# EAGLE design BC127_Breakout (EAGLE 6.4)
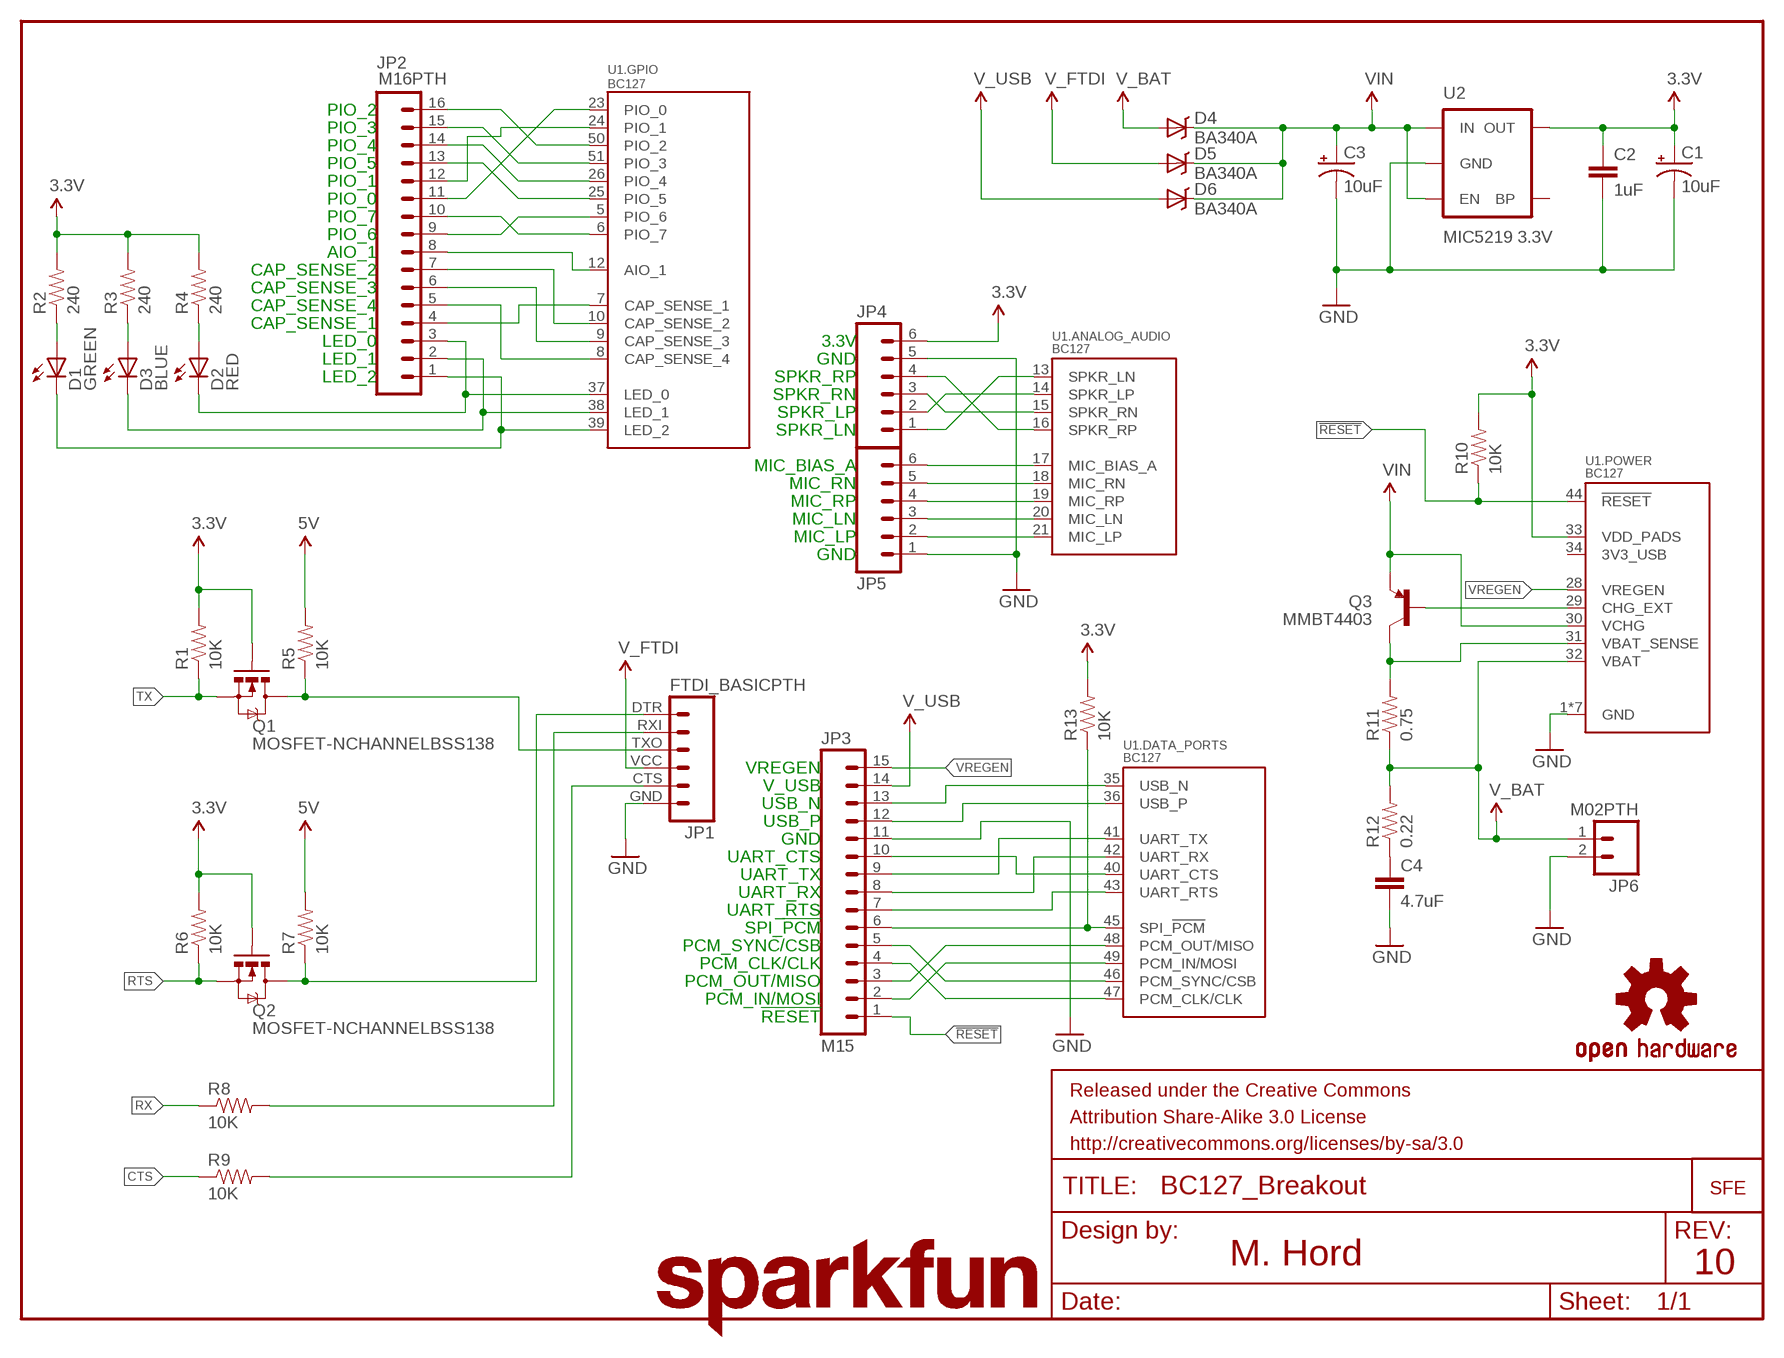
[diagram p0: schematic, sheet 1]

## Parts
C1  10uF  10UF-16V-10%(TANT)  [EIA3216]
C2  1uF  1UF-25V-10%(0805)  [0805]
C3  10uF  10UF-16V-10%(TANT)  [EIA3216]
C4  4.7uF  4.7UF-6.3V-10%(0603)0603  [0603-CAP]
D1  GREEN  LED-GREEN0603  [LED-0603]
D2  RED  LED-RED0603  [LED-0603]
D3  BLUE  LED-BLUE0603  [LED-0603]
D4  BA340A  B340A  [SMA-DIODE]
D5  BA340A  B340A  [SMA-DIODE]
D6  BA340A  B340A  [SMA-DIODE]
FRAME1  FRAME-LETTER  [CREATIVE_COMMONS]
JP1  FTDI_BASICPTH  [FTDI_BASIC]
JP2  M16PTH  [1X16]
JP3  M15  [1X15]
JP4  M06SIP  [1X06]
JP5  M06SIP  [1X06]
JP6  M02PTH  [1X02]
LOGO1  OSHW-LOGOM  [OSHW-LOGO-M]
LOGO2  LOGO-SFENEW  [SFE-NEW-WEBLOGO]
LOGO3  SFE_LOGO_NAME.1_INCH  [SFE_LOGO_NAME_.1]
Q1  MOSFET-NCHANNELBSS138  [SOT23]
Q2  MOSFET-NCHANNELBSS138  [SOT23]
Q3  MMBT4403  TRANSISTOR_PNPMMBT4403  [SOT23]
R1  10K  10KOHM1/10W1%(0603)0603  [0603-RES]
R2  240  240OHM1/10W1%(0603)  [0603-RES]
R3  240  240OHM1/10W1%(0603)  [0603-RES]
R4  240  240OHM1/10W1%(0603)  [0603-RES]
R5  10K  10KOHM1/10W1%(0603)0603  [0603-RES]
R6  10K  10KOHM1/10W1%(0603)0603  [0603-RES]
R7  10K  10KOHM1/10W1%(0603)0603  [0603-RES]
R8  10K  10KOHM1/10W1%(0603)0603  [0603-RES]
R9  10K  10KOHM1/10W1%(0603)0603  [0603-RES]
R10  10K  10KOHM1/10W1%(0603)0603  [0603-RES]
R11  0.75  0.75OHM1/4W1%(0805)  [0805]
R12  0.22  0.22OHM1/4W1%(0805)  [0805]
R13  10K  10KOHM1/10W1%(0603)0603  [0603-RES]
U1  BC127  BC127EXTRA_PASTE  [BC127_XTRA_PASTE]
U2  MIC5219 3.3V  V_REG_MIC52193.3V  [SOT23-5]

## Nets
3.3V: C1.A(+) C2.1 JP4.6 Q1.1(G) Q2.1(G) R1.2 R2.2 R3.2 R4.2 R6.2 R10.2 R13.2 U1.33(.POWER:VDD_PADS) U2.5(OUT)
5V_CTS: JP1.CTS R9.2
5V_RTS: JP1.DTR Q2.3(D) R7.1
5V_RX: JP1.RXI R8.2
5V_TX: JP1.TXO Q1.3(D) R5.1
!RESET: JP3.1 R10.1 U1.44(.POWER:!RESET)
AIO_1: JP2.8 U1.12(.GPIO:AIO_1)
CAP_SENSE_1: JP2.4 U1.7(.GPIO:CAP_SENSE_1)
CAP_SENSE_2: JP2.7 U1.10(.GPIO:CAP_SENSE_2)
CAP_SENSE_3: JP2.6 U1.9(.GPIO:CAP_SENSE_3)
CAP_SENSE_4: JP2.5 U1.8(.GPIO:CAP_SENSE_4)
CHG_EXT: Q3.1(B) U1.29(.POWER:CHG_EXT)
CTS: JP3.10 R9.1 U1.40(.DATA_PORTS:UART_CTS)
GND: C1.C(-) C2.2 C3.C(-) C4.2 JP1.GND JP3.11 JP4.5 JP5.1 JP6.2 U1.1(.POWER:GND) U1.2(.POWER:GND) U1.3(.POWER:GND) U1.4(.POWER:GND) U1.11(.POWER:GND) U1.22(.POWER:GND) U1.27(.POWER:GND) U2.2(GND)
LED_0: D2.C JP2.3 U1.37(.GPIO:LED_0)
LED_1: D3.C JP2.2 U1.38(.GPIO:LED_1)
LED_2: D1.C JP2.1 U1.39(.GPIO:LED_2)
MIC_BIAS_A: JP5.6 U1.17(.ANALOG_AUDIO:MIC_BIAS_A)
MIC_LN: JP5.3 U1.20(.ANALOG_AUDIO:MIC_LN)
MIC_LP: JP5.2 U1.21(.ANALOG_AUDIO:MIC_LP)
MIC_RN: JP5.5 U1.18(.ANALOG_AUDIO:MIC_RN)
MIC_RP: JP5.4 U1.19(.ANALOG_AUDIO:MIC_RP)
N$2: D3.A R3.1
N$6: D2.A R4.1
N$7: D1.A R2.1
N$28: C4.1 R12.1
PCM_CLK/CLK: JP3.4 U1.47(.DATA_PORTS:PCM_CLK/CLK)
PCM_IN/MOSI: JP3.2 U1.49(.DATA_PORTS:PCM_IN/MOSI)
PCM_OUT/MISO: JP3.3 U1.48(.DATA_PORTS:PCM_OUT/MISO)
PCM_SYNC/CSB: JP3.5 U1.46(.DATA_PORTS:PCM_SYNC/CSB)
PIO_0: JP2.11 U1.23(.GPIO:PIO_0)
PIO_1: JP2.12 U1.24(.GPIO:PIO_1)
PIO_2: JP2.16 U1.50(.GPIO:PIO_2)
PIO_3: JP2.15 U1.51(.GPIO:PIO_3)
PIO_4: JP2.14 U1.26(.GPIO:PIO_4)
PIO_5: JP2.13 U1.25(.GPIO:PIO_5)
PIO_6: JP2.9 U1.5(.GPIO:PIO_6)
PIO_7: JP2.10 U1.6(.GPIO:PIO_7)
RTS: JP3.7 Q2.2(S) R6.1 U1.43(.DATA_PORTS:UART_RTS)
RX: JP3.8 R8.1 U1.42(.DATA_PORTS:UART_RX)
SPI_!PCM: JP3.6 R13.1 U1.45(.DATA_PORTS:SPI_!PCM)
SPKR_LN: JP4.1 U1.13(.ANALOG_AUDIO:SPKR_LN)
SPKR_LP: JP4.2 U1.14(.ANALOG_AUDIO:SPKR_LP)
SPKR_RN: JP4.3 U1.15(.ANALOG_AUDIO:SPKR_RN)
SPKR_RP: JP4.4 U1.16(.ANALOG_AUDIO:SPKR_RP)
TX: JP3.9 Q1.2(S) R1.1 U1.41(.DATA_PORTS:UART_TX)
USB_N: JP3.13 U1.35(.DATA_PORTS:USB_N)
USB_P: JP3.12 U1.36(.DATA_PORTS:USB_P)
V_BAT: D4.A JP6.1 R11.1 R12.2 U1.32(.POWER:VBAT)
V_FTDI: D5.A JP1.VCC
V_USB: D6.A JP3.14
VBAT_SENSE: Q3.3(C) R11.2 U1.31(.POWER:VBAT_SENSE)
VIN: C3.A(+) D4.C D5.C D6.C Q3.2(E) R5.2 R7.2 U1.30(.POWER:VCHG) U2.1(IN) U2.3(EN) ; supply symbol labelled 5V
VREGEN: JP3.15 U1.28(.POWER:VREGEN)
Unconnected: U1.34(.POWER:3V3_USB) U2.4(BP)

## Notes on the sheet
- PIO_2
- PIO_3
- PIO_4
- PIO_5
- PIO_1
- PIO_0
- PIO_7
- PIO_6
- AIO_1
- CAP_SENSE_2
- CAP_SENSE_3
- CAP_SENSE_4
- CAP_SENSE_1
- LED_0 | 3.3V
- LED_1 | GND
- LED_2 | SPKR_RP
- SPKR_RN
- SPKR_LP
- SPKR_LN
- MIC_BIAS_A
- MIC_RN
- MIC_RP
- MIC_LN
- MIC_LP
- GND
- VREGEN
- V_USB
- USB_N
- USB_P
- GND
- UART_CTS
- UART_TX
- UART_RX
- UART_RTS
- SPI_!PCM
- PCM_SYNC/CSB
- PCM_CLK/CLK
- PCM_OUT/MISO
- PCM_IN/MOSI
- !RESET
- M. Hord | 10

## Library data of the parts
C1 C3 = SparkFun-Capacitors:10UF-16V-10%(TANT): CAP-00811 1206/EIA-3216 Tantalum capacitor; PROD_ID: CAP-00811
C2 = SparkFun-Capacitors:1UF-25V-10%(0805): CAP-08064; PROD_ID: CAP-08064
C4 = SparkFun-Capacitors:4.7UF-6.3V-10%(0603): CAP-08280; PROD_ID: CAP-08280
D1 = SparkFun-LED:LED-GREEN: Various green LEDs 0603- DIO-00821 LARGE- DIO-00862 LILYPAD- DIO-09910; PROD_ID: DIO-00821
D2 = SparkFun-LED:LED-RED: Assorted Red LEDs LilyPad 1206- DIO-09912 1206- DIO-00809 0603- DIO-00819; PROD_ID: DIO-00819
D3 = SparkFun-LED:LED-BLUE: Blue LEDs for production use Various blue LEDs stocked by SparkFun production 0603 - DIO-08575 Rebel - DIO-09553 1206 - DIO-09911; PROD_ID: DIO-08575
D4-D6 = SparkFun-DiscreteSemi:B340A: Schottky Diode 3A-40V; PROD_ID: DIO-09886
FRAME1 = SparkFun-Aesthetics:FRAME-LETTER: Schematic Frame Standard 8.5x11 US Letter frame
JP1 = SparkFun-Connectors:FTDI_BASIC: FTDI Basic header with labels
JP2 = SparkFun-Connectors:M16: 1x16 .1" header
JP3 = SparkFun-Connectors:M15: Header 15 Standard 15-pin 0.1" header. Use with straight break away headers (SKU : PRT-00116), right angle break away headers (PRT-00553), swiss pins (PRT-00743), machine pins (PRT-00117), and female headers (PRT-00115).
JP4 JP5 = SparkFun-Connectors:M06: Header 6 Standard 6-pin 0.1" header. Use with straight break away headers (SKU : PRT-00116), right angle break away headers (PRT-00553), swiss pins (PRT-00743), machine pins (PRT-00117), and female headers (PRT-00115). Molex polarized connector foot print use with SKU : PRT-08094 with associated crimp pins and housings. NOTES ON THE VARIANTS LOCK and LOCK_LONGPADS... This footprint was designed to help hold the alignment of a through-hole component (i.e. 6-pin header) while soldering it into place. You may notice that each hole has been shifted either up or down by 0.005 of an inch from it's more standard position (which is a perfectly straight line). This slight alteration caused the pins (the squares in the middle) to touch the edges of the holes. Because they are alternating, it causes a "brace" to hold the component in place. 0.005 has proven to be the perfect amount of "off-center" position when using our standard breakaway headers. Although looks a little odd when you look at the bare footprint, once you have a header in there, the alteration is very hard to notice. Also,if you push a header all the way into place, it is covered up entirely on the bottom side. This idea of altering the position of holes to aid alignment will be further integrated into the Sparkfun Library for other footprints. It can help hold any component with 3 or more connection pins.
JP6 = SparkFun-Connectors:M02: Standard 2-pin 0.1" header. Use with - straight break away headers ( PRT-00116) - right angle break away headers (PRT-00553) - swiss pins (PRT-00743) - machine pins (PRT-00117) - female headers (PRT-00115) Molex polarized connector foot print use with: PRT-08233 with associated crimp pins and housings. 2.54_SCREWTERM for use with PRT-10571. 3.5mm Screw Terminal footprints for PRT-08084 5mm Screw Terminal footprints for use with PRT-08433
LOGO1 = SparkFun-Aesthetics:OSHW-LOGO: Open Source Hardware Logo This logo indicates the piece of hardware it is found on incorporates a OSHW license and/or adheres to the definition of open source hardware found here: http://freedomdefined.org/OSHW
LOGO2 = SparkFun-Aesthetics:LOGO-SFE: Spark Fun Electronics PCB Logo This is the standard Spark Fun Electronics PCB logo.
LOGO3 = SparkFun-Aesthetics:SFE_LOGO_NAME: SFE Logo, name only This is the SparkFun name logo. The logo on the schematic will always be the same size; the package variant is the height of the flame part of the logo (or the height the flame would be, if it were drawn). Default layer for the logo on the board is tSilk.
Q1 Q2 = SparkFun-DiscreteSemi:MOSFET-NCHANNEL: Common NMOSFET Parts MFG P/N Store ID Prod ID FDD8780 TRANS-09984 SI7820DN TRANS-11055 FDS6630A IC-08089 2N7002PW TRANS-11151 FQP30N06L COM-10213 TRANS-10060 BSS123LT1G TRANS-08345 BSS138 TRANS-00830 BS170 2N7000; PROD_ID: TRANS-00830
Q3 = SparkFun-DiscreteSemi:TRANSISTOR_PNP: Generic PNP BJT Double check pinouts against datasheets- not all devices are the same! MMBT3906 - 40V 200mA SOT-23 (TRANS-08052) MMBT4403 - 40V 600mA SOT-23 (TRANS-09245); PROD_ID: TRANS-09245
R1 R5-R10 R13 = SparkFun-Resistors:10KOHM1/10W1%(0603): RES-00824; PROD_ID: RES-00824
R2-R4 = SparkFun-Resistors:240OHM1/10W1%(0603): RES-07849; PROD_ID: RES-07849
R11 = SparkFun-Resistors:0.75OHM1/4W1%(0805): RES-08474; PROD_ID: RES-08474
R12 = SparkFun-Resistors:0.22OHM1/4W1%(0805): RES-09883; PROD_ID: RES-09883
U1 = SparkFun-RF:BC127: Blue Creations BC127 BLE module Hyper-competent Bluetooth 4.0 module, with: - Pre-4.0 support - 4 Cap sense inputs - 1 Analog input - 8 GPIO - 3 Open-drain LED drivers - Onboard battery charge circuitry - SPP/UART support - PCM Audio support - SPI port - Built-in USB - All kinds of other crazy crap
U2 = SparkFun-PowerIC:V_REG_MIC5219: V_REG MIC5219 Standard 500mA LDO voltage regulator in SOT-23 layout. Micrel part MIC5219. BP (by-pass) pin is used to lower output noise with 470pF cap, may be left open.; PROD_ID: VREG-09872

## Board
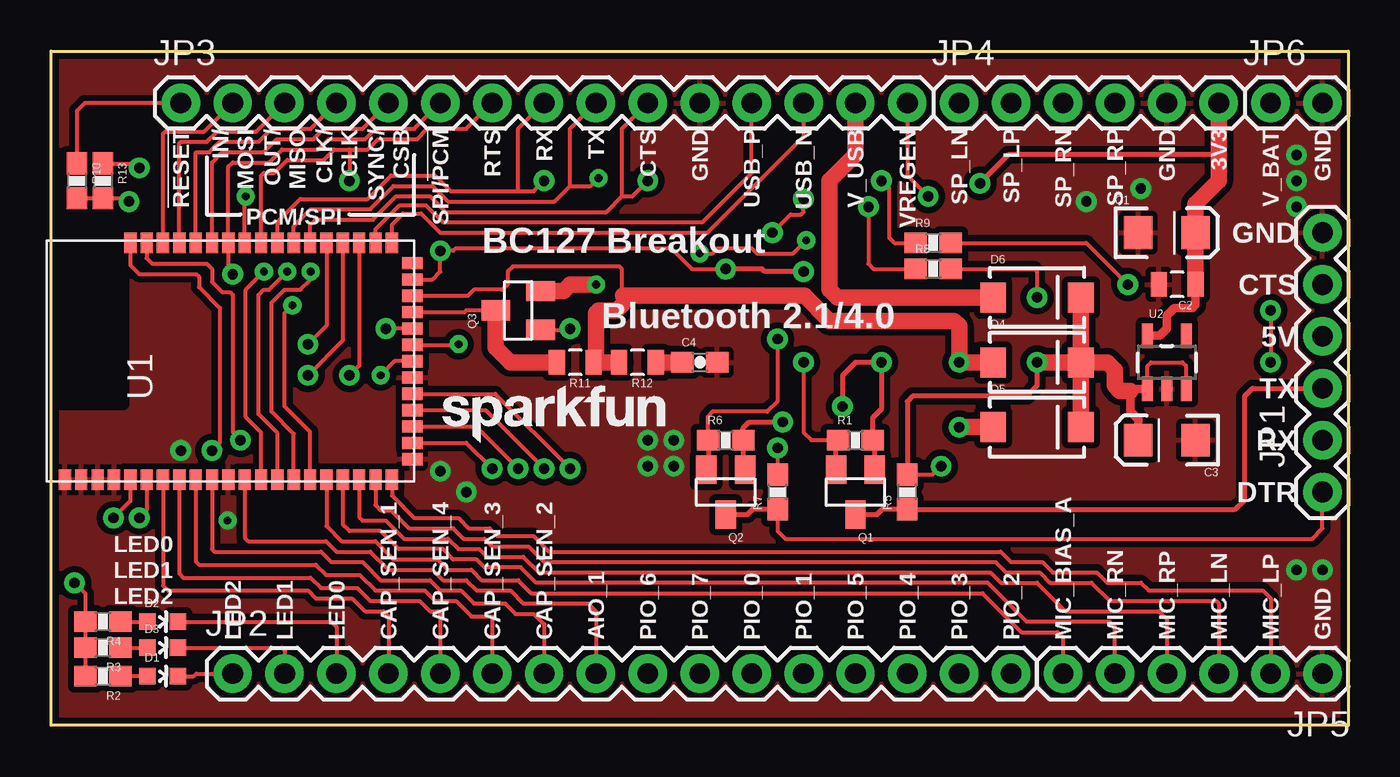
[diagram p1: board, top side]
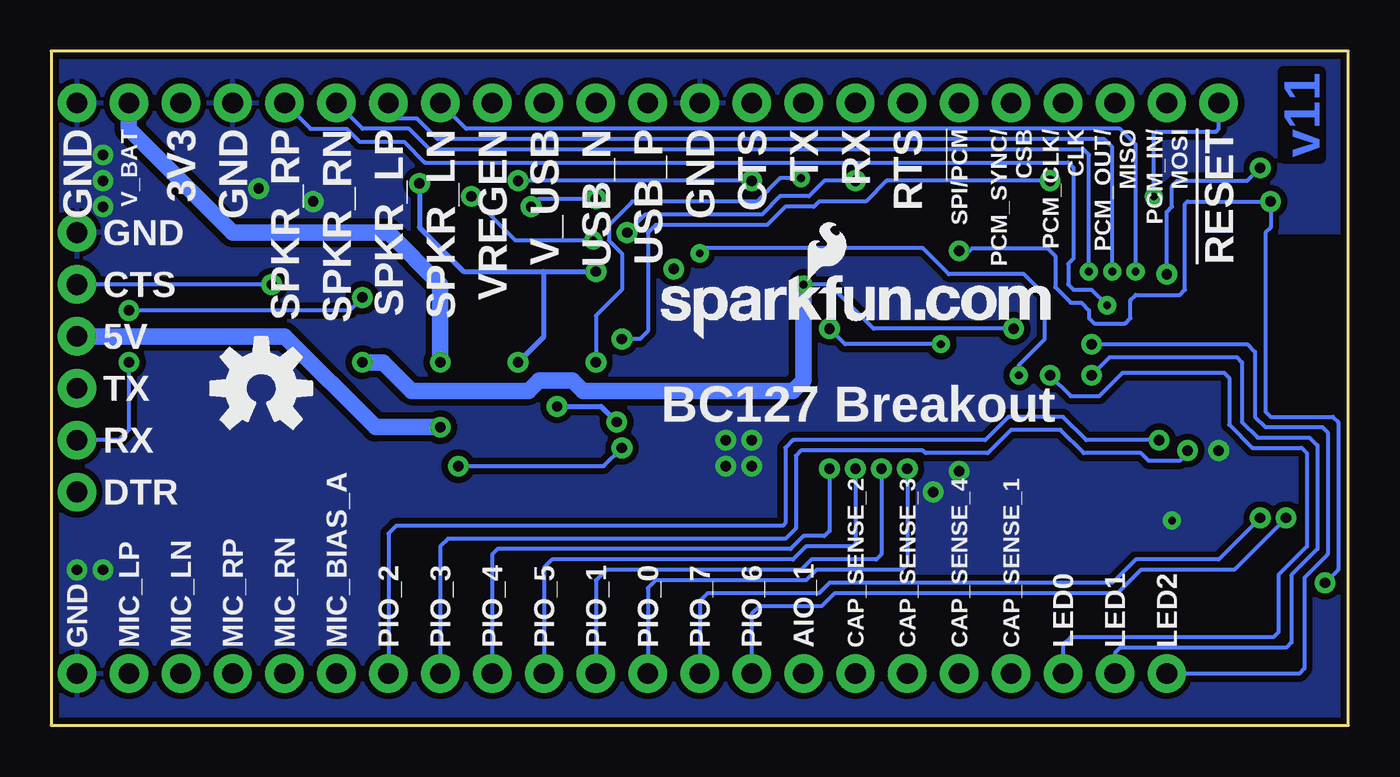
[diagram p2: board, bottom side, seen from below]

Size 63.5 x 33.02 mm. Coordinates in mm from the lower left corner, seen from the top.
Outline: 0,0 0,33.02 63.5,33.02 63.5,0 0,0
Copper layers (1*16): Top 0.035mm / dielectric 1.5mm / Bottom 0.035mm
Design rules "Sparkfun *": minimum track width 8mil, minimum drill 20mil, track to track 8mil, track to pad 8mil, pad to pad 8mil, via to via 8mil, smd to smd 8mil, copper to edge 8mil, drill to drill 8mil, minimum pad ring 12mil, minimum via ring 10mil, stop-mask expansion 4mil, vias tented up to drill 20mil, thermal gap 10mil

### Footprints (pad centres in the part's own frame; a part is rotated, then mirrored left to right if it is on the bottom)
EIA3216 = smd 1.4 x 1.6: A 1.4,0; C -1.4,0
0805 = smd 0.8 x 1.2: 1 -0.9,0; 2 0.9,0
0603-CAP = smd 1.1 x 1: 1 -0.85,0; 2 0.85,0
LED-0603 = smd 0.8 x 0.8: A 0,-0.75; C 0,0.75
SMA-DIODE = smd 1.27 x 1.47: A -2.15,0; C 2.15,0
FTDI_BASIC = drill 1.016 pad 1.88: CTS 10.16,0; DTR 0,0; GND 12.7,0; RXI 2.54,0; TXO 5.08,0; VCC 7.62,0
1X16 = drill 1.016 pad 1.88: 1 0,0; 2 2.54,0; 3 5.08,0; 4 7.62,0; 5 10.16,0; 6 12.7,0; 7 15.24,0; 8 17.78,0; 9 20.32,0; 10 22.86,0; 11 25.4,0; 12 27.94,0; 13 30.48,0; 14 33.02,0; 15 35.56,0; 16 38.1,0
1X15 = drill 1.016 pad 1.88: 1 0,0; 2 2.54,0; 3 5.08,0; 4 7.62,0; 5 10.16,0; 6 12.7,0; 7 15.24,0; 8 17.78,0; 9 20.32,0; 10 22.86,0; 11 25.4,0; 12 27.94,0; 13 30.48,0; 14 33.02,0; 15 35.56,0
1X06 = drill 1.016 pad 1.88: 1 0,0; 2 2.54,0; 3 5.08,0; 4 7.62,0; 5 10.16,0; 6 12.7,0
1X02 = drill 1.016 pad 1.88: 1 0,0; 2 2.54,0
SOT23 = smd 1 x 1.4: 1 -0.95,-1.1; 2 0.95,-1.1; 3 0,1.1
0603-RES = smd 1.1 x 1: 1 -0.85,0; 2 0.85,0
BC127_XTRA_PASTE = smd 1 x 0.6: 1 -5.8,8.1; 2 -5.8,7.3; 3 -5.8,6.5; 4 -5.8,5.7; 5 -5.8,4.9; 6 -5.8,4.1; 7 -5.8,3.3; 8 -5.8,2.5; 9 -5.8,1.7; 10 -5.8,0.9; 11 -5.8,0.1; 12 -5.8,-0.7; 13 -5.8,-1.5; 14 -5.8,-2.3; 15 -5.8,-3.1; 16 -5.8,-3.9; 17 -5.8,-4.7; 18 -5.8,-5.5; 19 -5.8,-6.3; 20 -5.8,-7.1; 21 -5.8,-7.9; 35 5.8,-7.9; 36 5.8,-7.1; 37 5.8,-6.3; 38 5.8,-5.5; 39 5.8,-4.7; 40 5.8,-3.9; 41 5.8,-3.1; 42 5.8,-2.3; 43 5.8,-1.5; 44 5.8,-0.7; 45 5.8,0.1; 46 5.8,0.9; 47 5.8,1.7; 48 5.8,2.5; 49 5.8,3.3; 50 5.8,4.1; 51 5.8,4.9 | smd 0.6 x 1: 22 -4.8,-8.9; 23 -4,-8.9; 24 -3.2,-8.9; 25 -2.4,-8.9; 26 -1.6,-8.9; 27 -0.8,-8.9; 28 0,-8.9; 29 0.8,-8.9; 30 1.6,-8.9; 31 2.4,-8.9; 32 3.2,-8.9; 33 4,-8.9; 34 4.8,-8.9
SOT23-5 = smd 0.55 x 1.2: 1 -0.95,-1.3; 2 0,-1.3; 3 0.95,-1.3; 4 0.95,1.3; 5 -0.95,1.3

### Placement (x,y rotation side)
C1  54.61,24.13 0 top
C2  55.12,21.59 180 top
C3  54.61,13.97 180 top
C4  31.75,17.78 0 top
D1  5.46,2.41 270 top
D2  5.46,5.08 270 top
D3  5.46,3.81 270 top
D4  48.26,17.78 0 top
D5  48.26,14.61 0 top
D6  48.26,20.95 0 top
FRAME1  21.59,-6.35 0 top  (outside the outline)
JP1  62.23,11.43 90 top
JP2  8.89,2.54 0 top
JP3  6.35,30.48 0 top
JP4  44.45,30.48 0 top
JP5  62.23,2.54 180 top
JP6  59.69,30.48 0 top
LOGO1  53.21,16.51 0 bottom
LOGO2  33.66,18.92 0 bottom
LOGO3  18.67,13.34 0 top
Q1  39.37,11.43 180 top
Q2  33.02,11.43 180 top
Q3  22.86,20.32 90 top
R1  39.37,13.97 0 top
R2  2.54,2.41 180 top
R3  2.54,3.81 180 top
R4  2.54,5.08 180 top
R5  41.91,11.43 90 top
R6  33.02,13.97 0 top
R7  35.56,11.43 90 top
R8  43.18,22.35 0 top
R9  43.18,23.62 0 top
R10  1.27,26.67 270 top
R11  25.65,17.78 180 top
R12  28.7,17.78 180 top
R13  2.54,26.67 270 top
U1  8.78,17.84 90 top
U2  54.61,17.78 0 top

### Tracks (layer width: path | path; a pad name or v marks a point on that pad's centre or on a via)
3.3V  (via drill 0.51)
  Top 0.203: R10.2 R13.2 3.64,25.82 v3.81,25.65 | v33.02,22.35 31.37,22.35 30.35,23.37 19.81,23.37 19.68,23.24 v19.05,23.24 v19.04,23.23 19.04,22.22 18.66,21.84 U1.33 | v1.14,6.99 1.69,6.44 R4.2 R3.2 R2.2
  Top 0.254: Q1.1 40.32,13.87 R1.2 40.22,15.07 40.64,15.49 v40.64,17.78 39.37,17.78 38.73,17.14 v38.73,15.62 | Q2.1 33.87,12.63 R6.2 33.87,14.57 34.16,14.86 v35.81,14.86 | 57.15,27.94 46.86,27.94 v45.47,26.54 | v36.83,22.22 34.92,22.22 34.8,22.35 v33.02,22.35
  Top 0.406: 56.01,21.6 56.01,20.57 55.88,20.45 54.99,20.45 54.61,20.07 54.61,19.43 54.26,19.08 U2.5
  Top 0.813: JP4.6 57.15,27.94 57.15,26.67 56.01,25.53 C1.A | C1.A | C1.A 56.01,21.6 C2.1
  Bottom 0.203: v19.05,23.24 18.54,23.24 18.41,23.37 14.73,23.37 14.35,22.99 14.35,21.46 13.59,20.7 13.08,20.7 12.7,20.32 12.7,19.94 12.45,19.68 10.92,19.68 10.67,19.94 10.67,20.83 10.41,21.08 8.26,21.08 8,21.34 8,25.53 7.87,25.65 v3.81,25.65 3.81,24.38 4.06,24.13 4.06,15.37 3.81,15.11 0.76,15.11 0.51,14.86 0.51,7.62 v1.14,6.99
  Bottom 0.254: v45.47,26.54 45.47,24.38 43.31,22.22 39.4,22.22 | 39.4,22.22 v36.83,22.22 | 39.4,22.22 39.4,19.02 v40.64,17.78 | v38.73,15.62 36.58,15.62 v35.81,14.86
5V_CTS  (via drill 0.51)
  Top 0.203: R9.2 50.67,23.62 v52.7,21.59
  Bottom 0.203: v52.7,21.59 JP1.CTS
5V_RTS
  Top 0.203: R7.1 35.56,9.53 35.94,9.14 61.72,9.14 62.23,9.65 JP1.DTR
  Top 0.254: Q2.3 34.08,10.33 34.33,10.58 R7.1
5V_RX  (via drill 0.51)
  Top 0.203: R8.2 48.13,22.35 48.26,22.22 v48.26,20.95 | v59.69,20.32 v59.69,17.78
  Bottom 0.203: v48.26,20.95 48.9,20.32 v59.69,20.32 | v59.69,17.78 59.69,14.48 60.2,13.97 JP1.RXI
5V_TX
  Top 0.254: Q1.3 40.43,10.33 40.68,10.58 R5.1 57.95,10.58 58.42,11.05 58.42,16.13 58.8,16.51 JP1.TXO
!RESET  (via drill 0.38)
  Top 0.203: JP3.1 1.65,30.48 1.27,30.1 R10.1 | U1.44 9.48,25.86 v9.53,25.91
  Bottom 0.203: v9.53,25.91 9.53,28.96 9.4,29.08 6.48,29.08 6.35,29.21 JP3.1
AIO_1
  Top 0.203: U1.12 9.48,9.19 9.65,9.02 13.46,9.02 13.97,8.51 15.62,8.51 16.51,7.62 18.67,7.62 19.18,7.11 20.32,7.11 20.83,6.6 22.48,6.6 23.11,5.97 26.29,5.97 26.67,5.59 JP2.8
CAP_SENSE_1
  Top 0.203: U1.7 5.48,6.84 5.71,6.6 12.57,6.6 12.95,6.22 14.73,6.22 15.37,5.59 16.26,5.59 16.51,5.33 JP2.4
CAP_SENSE_2
  Top 0.203: U1.10 7.88,8.63 8,8.51 13.21,8.51 13.72,8 15.24,8 16.13,7.11 18.54,7.11 19.05,6.6 20.07,6.6 20.7,5.97 22.23,5.97 22.73,5.46 23.62,5.46 24.13,4.95 JP2.7
CAP_SENSE_3
  Top 0.203: U1.9 7.08,8.03 7.24,7.87 12.95,7.87 13.46,7.37 15.11,7.37 15.88,6.6 18.29,6.6 18.8,6.1 19.81,6.1 20.57,5.33 21.59,5.33 JP2.6
CAP_SENSE_4
  Top 0.203: U1.8 6.28,7.44 6.48,7.24 12.7,7.24 13.21,6.73 14.99,6.73 15.62,6.1 18.03,6.1 18.54,5.59 18.92,5.59 19.05,5.46 JP2.5
CHG_EXT  (via drill 0.38, 0.51)
  Top 0.203: U1.29 19.91,18.64 v19.94,18.67 | Q3.1 25.34,19.37 v25.4,19.43
  Bottom 0.203: v19.94,18.67 24.64,18.67 v25.4,19.43
CTS  (via drill 0.51)
  Top 0.203: U1.40 12.68,24.49 12.95,24.77 15.75,24.77 16.89,25.91 18.54,25.91 19.3,25.15 27.18,25.15 27.94,25.91 | 27.94,25.91 28.45,25.91 v29.21,26.67 | 27.94,25.91 27.94,29.21 JP3.10 | v40.64,26.67 41.02,26.29 41.02,23.88 41.27,23.62 R9.1
  Bottom 0.203: v29.21,26.67 v40.64,26.67
GND  (via drill 0.38, 0.51)
  other vias: 29.21,12.7 8.64,10.03 60.96,7.62 62.23,7.62 20.32,11.43 19.05,12.45 29.21,13.97 30.48,12.7 30.48,13.97 50.67,25.65 53.34,26.29 60.96,26.67 60.96,25.4 60.96,27.94 6.35,13.46
  pour Top (isolate 0.305): 0,33.02 63.5,33.02 63.5,0 0,0
  pour Bottom (isolate 0.305): 0,33.02 63.5,33.02 63.5,0 0,0
LED_0  (via drill 0.51)
  Top 0.203: D2.C 13.72,5.08 13.97,4.83 JP2.3 | U1.37 15.08,17.62 v14.61,17.14
  Bottom 0.203: v14.61,17.14 13.59,16.13 12.19,16.13 11.05,17.27 6.1,17.27 5.84,17.02 5.84,14.73 4.7,13.59 2.29,13.59 2.03,13.34 2.03,8.76 3.43,7.37 3.43,4.57 3.68,4.32 13.59,4.32 13.97,3.94 JP2.3
LED_1  (via drill 0.51)
  Top 0.203: D3.C 11.3,3.81 11.43,3.68 JP2.2 | U1.38 14.28,18.85 v12.57,17.14
  Bottom 0.203: v12.57,17.14 11.68,18.03 5.46,18.03 5.21,17.78 5.21,14.86 4.45,14.1 1.91,14.1 1.52,13.72 1.52,8.64 2.79,7.37 2.79,4.06 3.05,3.81 11.18,3.81 11.43,3.56 JP2.2
LED_2  (via drill 0.51)
  Top 0.203: D1.C 6.99,2.41 7.11,2.54 JP2.1 | U1.39 13.48,19.58 v12.57,18.67
  Bottom 0.203: v12.57,18.67 4.95,18.67 4.57,18.29 4.57,15.11 4.06,14.61 1.27,14.61 1.02,14.35 1.02,8.38 2.16,7.24 2.16,2.79 2.41,2.54 JP2.1
MIC_BIAS_A
  Top 0.203: U1.17 13.48,9.76 14.22,9.02 15.88,9.02 16.76,8.13 18.92,8.13 19.43,7.62 20.57,7.62 21.08,7.11 22.86,7.11 23.5,6.48 45.59,6.48 47.5,4.57 49.28,4.57 49.53,4.32 JP5.6
MIC_LN
  Top 0.203: U1.20 15.88,10.79 16.13,10.54 16.64,10.54 17.53,9.65 19.68,9.65 20.19,9.14 21.21,9.14 21.59,8.76 23.37,8.76 24.13,8 46.23,8 46.74,7.49 48.39,7.49 48.9,6.99 50.93,6.99 51.82,6.1 57.02,6.1 57.15,5.97 JP5.3
MIC_LP
  Top 0.203: U1.21 16.68,11.26 17.78,10.16 19.94,10.16 20.45,9.65 21.46,9.65 21.84,9.27 23.62,9.27 24.38,8.51 46.48,8.51 46.99,8 48.51,8 49.02,7.49 51.18,7.49 51.69,6.99 53.34,6.99 53.72,6.6 59.31,6.6 59.69,6.22 JP5.2
MIC_RN
  Top 0.203: JP5.5 52.07,4.83 51.82,5.08 47.75,5.08 45.85,6.99 23.75,6.99 22.99,7.75 21.21,7.75 20.83,8.13 19.68,8.13 19.18,8.64 17.02,8.64 16.13,9.53 14.61,9.53 14.28,9.85 U1.18
MIC_RP
  Top 0.203: U1.19 15.08,10.19 15.24,10.03 16.38,10.03 17.27,9.14 19.43,9.14 19.94,8.64 20.95,8.64 21.34,8.25 23.11,8.25 23.88,7.49 45.97,7.49 46.48,6.99 48.26,6.99 49.66,5.59 54.23,5.59 54.61,5.21 JP5.4
N$2
  Top 0.203: R3.1 D3.A
N$6
  Top 0.203: R4.1 D2.A
N$7
  Top 0.203: D1.A R2.1
N$28
  Top 0.813: R12.1 C4.1
PCM_CLK/CLK
  Top 0.203: U1.47 7.08,28.04 7.11,28.07 7.75,28.07 8.26,28.57 10.16,28.57 10.79,29.21 12.7,29.21 JP3.4
PCM_IN/MOSI
  Top 0.203: JP3.2 7.49,29.08 5.59,29.08 5.48,28.97 U1.49
PCM_OUT/MISO
  Top 0.203: U1.48 6.28,28.5 6.35,28.57 7.62,28.57 8.13,29.08 10.03,29.08 JP3.3
PCM_SYNC/CSB
  Top 0.203: U1.46 7.88,27.56 8.38,28.07 10.41,28.07 11.05,28.7 12.83,28.7 13.34,29.21 15.24,29.21 JP3.5
PIO_0  (via drill 0.51)
  Top 0.203: U1.23 20.32,13.84 v21.59,12.57
  Bottom 0.203: v21.59,12.57 21.59,7.87 21.84,7.62 26.04,7.62 26.54,7.11 33.91,7.11 34.29,6.73 JP2.11
PIO_1  (via drill 0.51)
  Top 0.203: U1.24 20.8,14.64 v22.86,12.57
  Bottom 0.203: v22.86,12.57 22.86,8.38 23.11,8.13 26.29,8.13 26.8,7.62 36.32,7.62 36.83,7.11 JP2.12
PIO_2  (via drill 0.51)
  Top 0.203: U1.50 4.68,22.88 4.95,22.61 7.62,22.61 7.87,22.35 7.87,21.72 8.38,21.21 8.76,21.21 8.89,21.08 8.89,14.35 v9.27,13.97
  Bottom 0.203: v9.27,13.97 12.83,13.97 13.97,15.11 16.64,15.11 17.78,13.97 27.18,13.97 27.56,13.59 27.56,9.91 27.69,9.78 46.61,9.78 46.99,9.4 JP2.16
PIO_3  (via drill 0.51)
  Top 0.203: U1.51 3.88,22.54 4.32,22.1 7.11,22.1 7.24,21.97 7.24,21.46 8.26,20.45 8.26,13.84 v7.87,13.46
  Bottom 0.203: v7.87,13.46 7.87,13.34 8.26,12.95 9.78,12.95 10.16,13.34 12.95,13.34 14.1,14.48 16.51,14.48 17.65,13.34 20.7,13.34 20.83,13.46 26.8,13.46 27.05,13.21 27.05,9.65 27.56,9.14 44.07,9.14 44.45,8.76 JP2.15
PIO_4  (via drill 0.51)
  Top 0.203: U1.26 21.73,16.24 v25.4,12.57
  Bottom 0.203: v25.4,12.57 25.4,9.53 25.65,9.27 26.67,9.27 27.3,8.64 41.66,8.64 41.91,8.38 JP2.14
PIO_5  (via drill 0.51)
  Top 0.203: U1.25 21.27,15.44 v24.13,12.57
  Bottom 0.203: v24.13,12.57 24.13,8.89 24.26,8.76 26.54,8.76 27.18,8.13 38.99,8.13 39.37,7.75 JP2.13
PIO_6  (via drill 0.51)
  Top 0.203: U1.5 3.88,10.99 v3.05,10.16
  Bottom 0.203: v3.05,10.16 5.59,7.62 10.16,7.62 11.3,6.48 25.15,6.48 25.78,5.84 28.83,5.84 29.21,5.46 JP2.9
PIO_7  (via drill 0.51)
  Top 0.203: U1.6 4.68,10.52 v4.32,10.16
  Bottom 0.203: v4.32,10.16 6.35,8.13 10.41,8.13 11.56,6.99 25.4,6.99 25.91,6.48 31.37,6.48 31.75,6.1 JP2.10
RTS  (via drill 0.51)
  Top 0.203: U1.43 10.28,26.92 10.41,27.05 10.92,27.05 11.56,27.69 13.34,27.69 13.84,28.19 14.61,28.19 | 14.61,28.19 15.49,28.19 16,28.7 17.91,28.7 18.41,29.21 20.32,29.21 JP3.7 | 14.61,28.19 v14.61,26.67 | v35.56,18.92 35.56,15.88 35.05,15.37 32.38,15.37 32.13,15.11 32.13,14.01 R6.1
  Top 0.254: R6.1 32.17,12.63 Q2.2
  Bottom 0.203: v14.61,26.67 22.61,26.67 23.62,25.65 25.91,25.65 26.16,25.4 27.56,25.4 28.45,24.51 33.91,24.51 34.29,24.13 34.29,19.3 34.67,18.92 v35.56,18.92
RX  (via drill 0.51)
  Top 0.203: U1.42 11.08,24.67 12.19,25.78 15.49,25.78 16.64,26.92 18.8,26.92 19.56,26.16 22.86,26.16 | 22.86,26.16 22.86,29.21 JP3.8 | 22.86,26.16 23.62,26.16 v24.13,26.67 | v35.31,24.13 36.2,25.02 36.7,25.02 36.83,25.15 v36.83,25.78 | v40.01,25.4 40.01,22.61 40.26,22.35 R8.1
  Bottom 0.203: v24.13,26.67 25.65,26.67 26.42,25.91 27.81,25.91 28.7,25.02 34.42,25.02 v35.31,24.13 | v36.83,25.78 39.62,25.78 v40.01,25.4
SPI_!PCM  (via drill 0.51)
  Top 0.203: JP3.6 17.78,29.21 15.88,29.21 15.37,28.7 13.59,28.7 13.08,28.19 11.3,28.19 10.67,27.56 8.89,27.56 8.68,27.35 U1.45 8.68,22.31 v8.89,22.1 | R13.1 4.1,27.52 v4.32,27.3
  Bottom 0.203: v8.89,22.1 8.89,25.15 8.64,25.4 8.64,26.42 8.38,26.67 4.95,26.67 v4.32,27.3
SPKR_LN  (via drill 0.38)
  Top 0.203: U1.13 10.28,14.36 9.53,15.11 9.53,21.34 v10.41,22.22
  Bottom 0.203: v10.41,22.22 10.41,28.45 11.18,29.21 43.18,29.21 JP4.1
SPKR_LP  (via drill 0.38)
  Top 0.203: U1.14 11.08,14.32 10.16,15.24 10.16,21.08 10.41,21.34 10.67,21.34 v11.56,22.22
  Bottom 0.203: v11.56,22.22 11.56,28.32 11.94,28.7 44.58,28.7 45.59,29.72 46.74,29.72 46.99,29.97 JP4.2
SPKR_RN  (via drill 0.38)
  Top 0.203: U1.15 11.88,14.28 10.79,15.37 10.79,20.7 11.43,21.34 12.19,21.34 12.7,21.84 v12.7,22.22
  Bottom 0.203: v12.7,22.22 12.7,27.94 12.95,28.19 44.96,28.19 45.97,29.21 48.26,29.21 JP4.3
SPKR_RP  (via drill 0.38)
  Top 0.203: U1.16 12.68,14.37 11.43,15.62 11.43,20.19 v11.81,20.57
  Bottom 0.203: JP4.4 50.8,29.21 49.02,29.21 48.39,28.57 46.23,28.57 45.21,27.56 13.72,27.56 13.46,27.3 13.46,22.86 13.72,22.61 13.72,21.59 13.46,21.34 12.57,21.34 v11.81,20.57
TX  (via drill 0.38, 0.51)
  Top 0.203: U1.41 11.88,24.45 12.7,25.27 15.62,25.27 16.76,26.42 18.67,26.42 19.43,25.65 24.64,25.65 25.4,26.42 | 25.4,26.42 26.42,26.42 v26.8,26.8 | 25.4,26.42 25.4,29.21 JP3.9 | v36.83,17.78 36.83,14.35 37.21,13.97 R1.1
  Top 0.254: Q1.2 38.42,13.87 R1.1
  Bottom 0.203: v26.8,26.8 27.81,26.8 28.96,25.65 35.05,25.65 36.2,24.51 36.2,23.75 35.56,23.11 35.56,21.34 36.83,20.07 v36.83,17.78
USB_N
  Top 0.203: U1.35 16.68,24.52 17.23,25.07 18.11,25.07 19.05,24.13 32.13,24.13 36.83,28.83 JP3.13
USB_P
  Top 0.203: U1.36 15.88,24.29 17.06,25.48 18.34,25.48 19.18,24.64 31.88,24.64 34.29,27.05 JP3.12
V_BAT  (via drill 0.51)
  Top 0.203: 26.67,20.19 26.8,20.32 | U1.32 20.4,21.04 20.7,21.34 22.1,21.34 22.35,21.59 22.35,22.22 22.61,22.48 27.81,22.48 27.94,22.35 27.94,21.08 27.98,21.04 27.94,20.99 27.94,20.57
  Top 0.813: D4.A v44.45,17.78 44.45,19.56 44.2,19.81 38.1,19.81 36.87,21.04 27.98,21.04 | R11.1 26.67,17.78 | 26.67,17.78 R12.2 | 26.67,17.78 26.67,20.19 | 26.8,20.32 27.69,20.32 27.94,20.57
  Bottom 0.813: JP6.1 59.69,29.21 54.61,24.13 46.99,24.13 44.45,21.59 v44.45,17.78
V_FTDI  (via drill 0.51)
  Top 0.813: D5.A v44.45,14.61
  Bottom 0.813: v44.45,14.61 47.62,14.61 52.07,19.05 JP1.VCC
V_USB
  Top 0.813: JP3.14 39.37,27.94 38.1,26.67 38.1,21.34 38.48,20.95 D6.A
VBAT_SENSE
  Top 0.203: U1.31 20.24,20.24 20.32,20.32 Q3.3
  Top 0.813: R11.2 22.48,17.78 21.76,18.5 Q3.3
VIN  (via drill 0.38, 0.51)
  Top 0.203: U2.1 53.66,17.59 53.85,17.78 55.37,17.78 55.56,17.59 U2.3 | R5.2 43.14,12.28 v43.56,12.7 | v35.56,13.59 R7.2 | U1.30 v16.39,19.44 v16.38,19.43
  Top 0.254: v48.26,17.78 48.26,16.64 47.75,16.13 42.16,16.13 41.91,15.88 R5.2
  Top 0.406: U2.1 52.93,16.48 52.83,16.38 52.83,15.37 53.21,14.99 C3.A
  Top 0.813: D6.C D4.C | D4.C D5.C | D4.C 51.69,17.78 52.07,17.4 52.07,16.64 52.32,16.38 52.83,16.38 | D4.C v48.26,17.78 | v26.67,21.59 25.4,21.59 25.08,21.27 Q3.2
  Bottom 0.203: v16.38,19.43 23.24,19.43 25.4,21.59 v26.67,21.59 | v43.56,12.7 36.45,12.7 v35.56,13.59
  Bottom 0.813: v48.26,17.78 47.24,17.78 45.85,16.38 40.13,16.38 39.62,16.89 37.97,16.89 37.47,16.38 27.18,16.38 26.67,16.89 v26.67,21.59
VREGEN  (via drill 0.38, 0.51)
  Top 0.203: U1.28 16.82,17.84 v16.13,17.14 | v31.75,23.11 32.38,23.11 32.64,23.37 34.29,23.37 34.54,23.11 36.32,23.11 v36.96,23.75 | JP3.15 41.91,26.92 v42.93,25.91
  Bottom 0.203: v16.13,17.14 16.13,17.65 14.86,18.92 14.86,21.08 15.88,22.1 19.56,22.1 20.83,23.37 31.5,23.37 v31.75,23.11 | v36.96,23.75 40.77,23.75 v42.93,25.91

### Text on the board
Bottom: v11
tPlace: !RESET | IN/ / MOSI | OUT/ / MISO | CLK/ / CLK | SYNC/ / CSB | SPI/!PCM | RTS | RX | TX | CTS | GND | USB_P | USB_N | V_USB | VREGEN | SP_LN | SP_LP | SP_RN | SP_RP | GND | 3V3 | V_BAT | GND | PCM/SPI | GND | BC127 Breakout | CTS | Bluetooth 2.1/4.0 | 5V | TX | RX | DTR | LED0 | LED1 | LED2 | LED2 | LED1 | LED0 | CAP_SEN_1 | CAP_SEN_4 | CAP_SEN_3 | CAP_SEN_2 | AIO_1 | PIO_6 | PIO_7 | PIO_0 | PIO_1 | PIO_5 | PIO_4 | PIO_3 | PIO_2 | MIC_BIAS_A | MIC_RN | MIC_RP | MIC_LN | MIC_LP | GND
bPlace: !RESET | PCM_IN/ / MOSI | PCM_OUT/ / MISO | PCM_CLK/ / CLK | PCM_SYNC/ / CSB | SPI/!PCM | RTS | RX | TX | CTS | GND | USB_P | USB_N | V_USB | VREGEN | SPKR_LN | SPKR_LP | SPKR_RN | SPKR_RP | GND | 3V3 | V_BAT | GND | GND | CTS | 5V | TX | BC127 Breakout | RX | DTR | LED2 | LED1 | LED0 | CAP_SENSE_1 | CAP_SENSE_4 | CAP_SENSE_3 | CAP_SENSE_2 | AIO_1 | PIO_6 | PIO_7 | PIO_0 | PIO_0 | PIO_1 | PIO_5 | PIO_4 | PIO_3 | PIO_2 | MIC_BIAS_A | MIC_RN | MIC_RP | MIC_LN | MIC_LP | GND
tNames: M. Hord